# Altium project Alim2015.PrjPCB
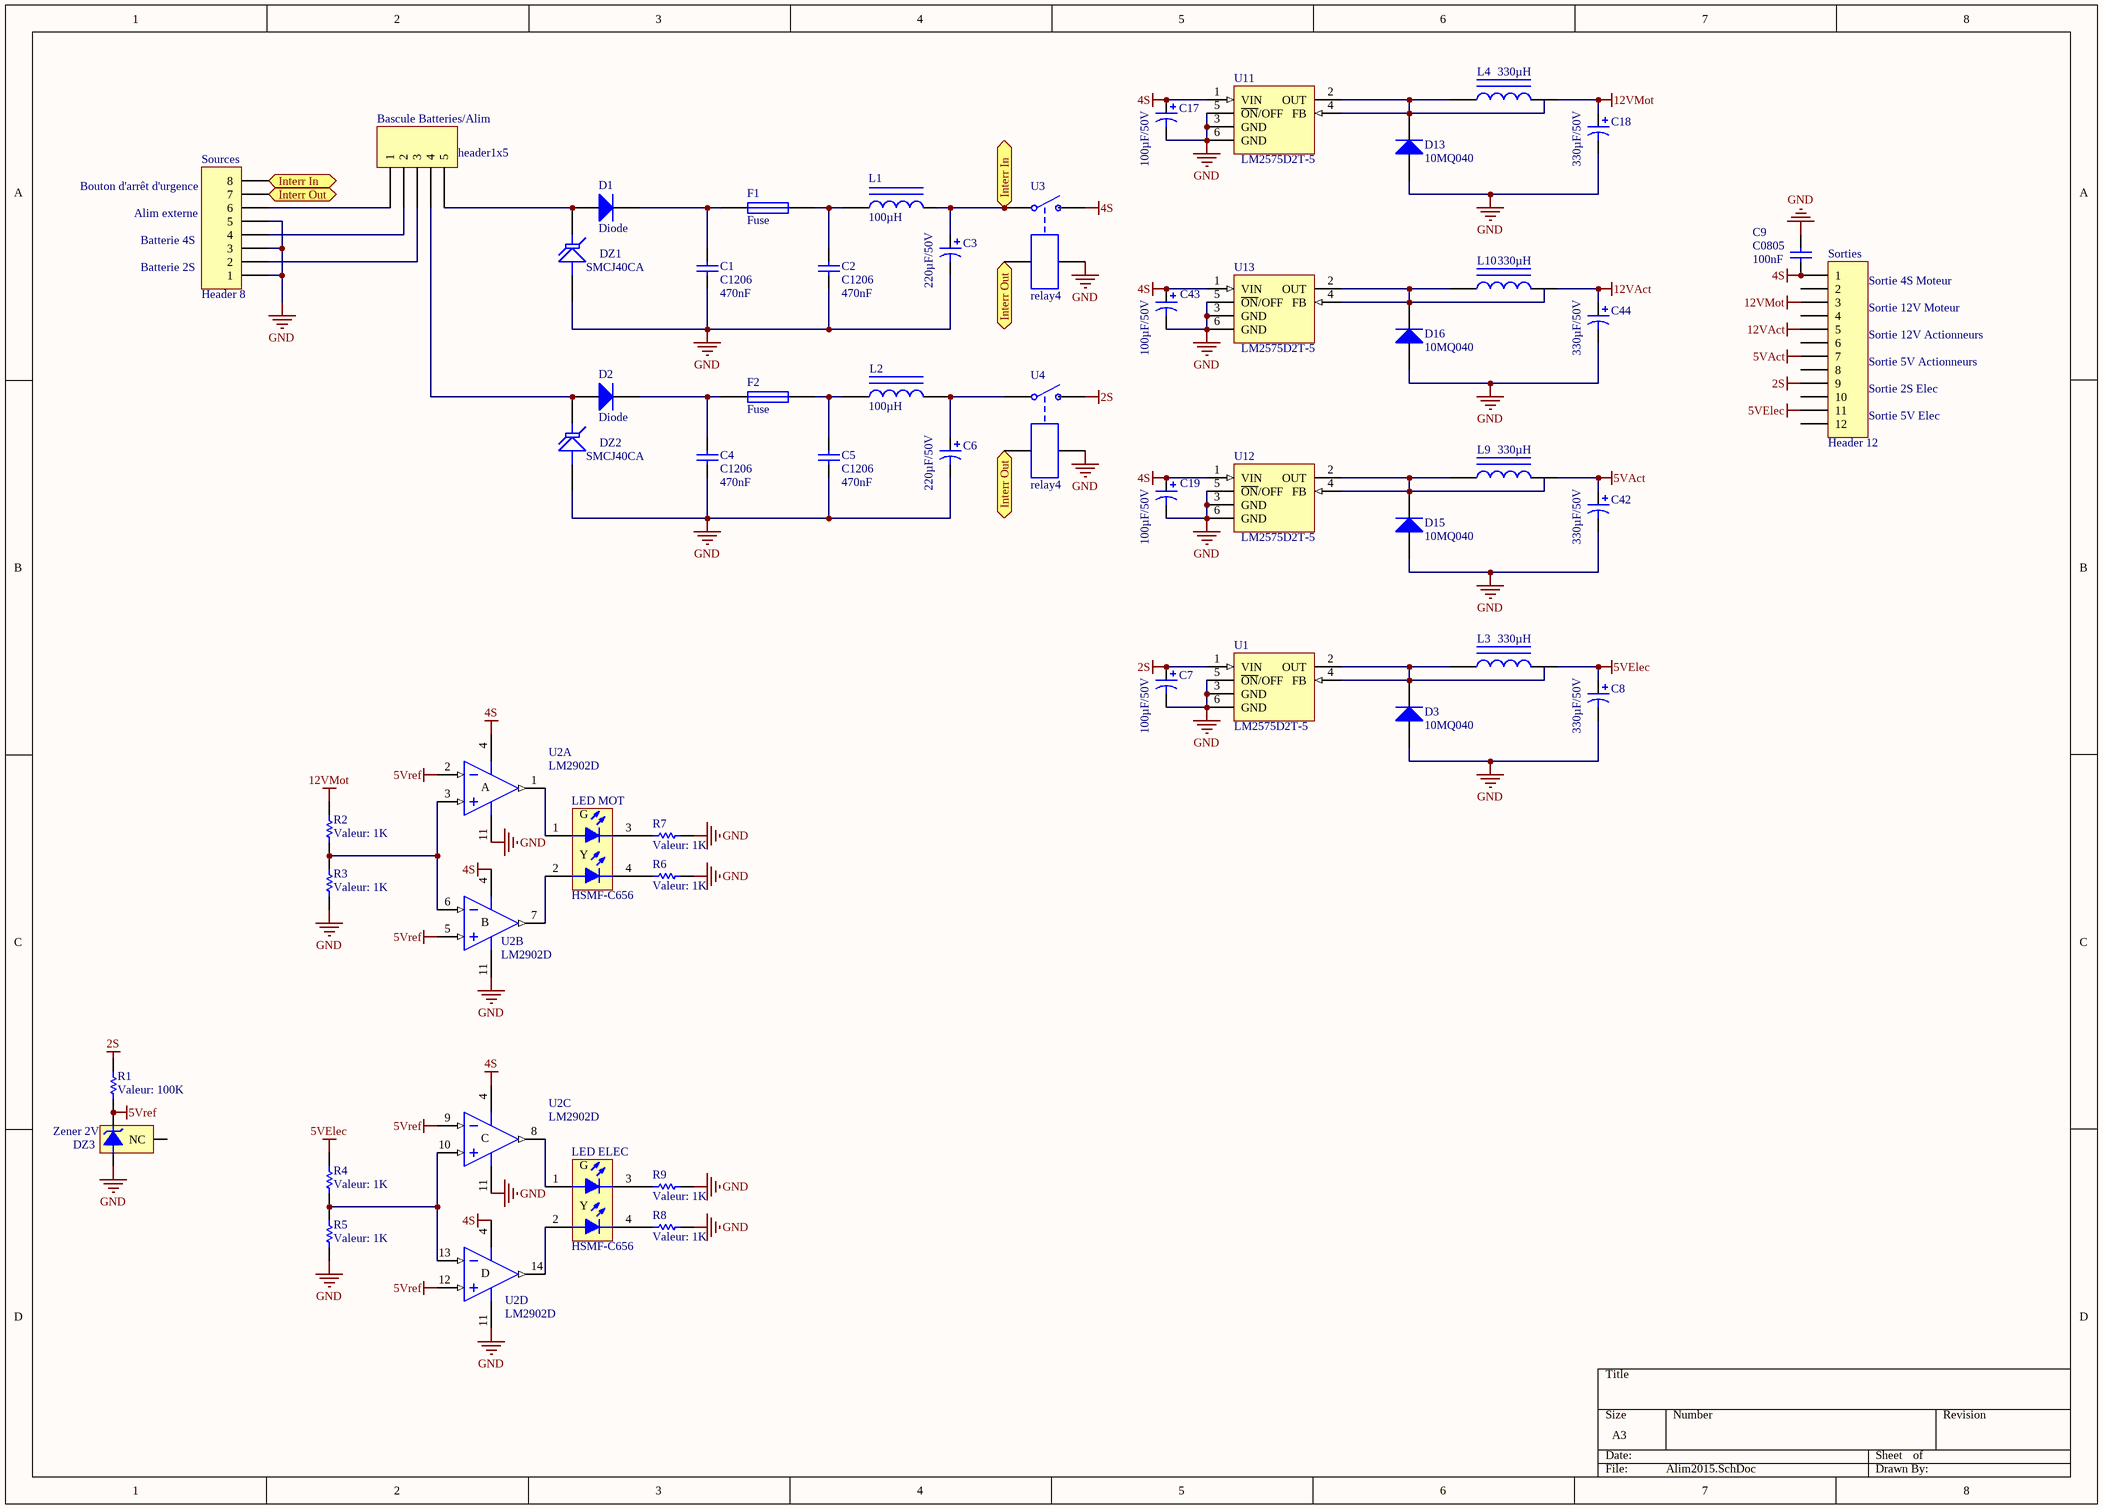
[diagram p0: Alim2015.SchDoc]
1 sheet, 53 parts. Net scope: flat (ports and power ports of the same name join across sheets).
Board file: Alim2015.PcbDoc

## Sheet Alim2015.SchDoc
size A3

### Parts
Bascule_Batteries/Alim  header1x5  [HDR1X4]
C1  C1206  value 470nF  [1206]
C2  C1206  value 470nF  [1206]
C3  220µF/50V  [Cap-D6]
C4  C1206  value 470nF  [1206]
C5  C1206  value 470nF  [1206]
C6  220µF/50V  [Cap-D6]
C7  100µF/50V  [Cap-D6]
C8  330µF/50V  [Cap-D6]
C9  C0805  value 100nF  [0805]
C17  100µF/50V  [Cap-D6]
C18  330µF/50V  [Cap-D6]
C19  100µF/50V  [Cap-D6]
C42  330µF/50V  [Cap-D6]
C43  100µF/50V  [Cap-D6]
C44  330µF/50V  [Cap-D6]
D1  Diode  [DSO-C2/X3.3]
D2  Diode  [DSO-C2/X3.3]
D3  10MQ040  [DSO-C2/X1.8]
D13  10MQ040  [DSO-C2/X1.8]
D15  10MQ040  [DSO-C2/X1.8]
D16  10MQ040  [DSO-C2/X1.8]
DZ1  SMCJ40CA  [DSO-C2/X3.3]
DZ2  SMCJ40CA  [DSO-C2/X3.3]
DZ3  Zener 2V  [MF03A_N]
F1  Fuse  [FUSE MF-SM050]
F2  Fuse  [FUSE MF-SM050]
L1  100µH  [SELF1]
L2  100µH  [SELF1]
L3  330µH  [SELF1]
L4  330µH  [SELF1]
L9  330µH  [SELF1]
L10  330µH  [SELF1]
LED_ELEC  HSMF-C656  [3.2X2.7X1.1A]
LED_MOT  HSMF-C656  [3.2X2.7X1.1A]
R1  Valeur: 100K  [ERA-0805]  (hidden comment: ERA6Y)
R2  Valeur: 1K  [ERA-0805]  (hidden comment: ERA6Y)
R3  Valeur: 1K  [ERA-0805]  (hidden comment: ERA6Y)
R4  Valeur: 1K  [ERA-0805]  (hidden comment: ERA6Y)
R5  Valeur: 1K  [ERA-0805]  (hidden comment: ERA6Y)
R6  Valeur: 1K  [ERA-0805]  (hidden comment: ERA6Y)
R7  Valeur: 1K  [ERA-0805]  (hidden comment: ERA6Y)
R8  Valeur: 1K  [ERA-0805]  (hidden comment: ERA6Y)
R9  Valeur: 1K  [ERA-0805]  (hidden comment: ERA6Y)
Sorties  Header 12  [HDR1X12]
Sources  Header 8  [EMBMCS8]
U1  LM2575D2T-5  [936A-02]
U2  LM2902D  [D014_N]  (parts A,B,C,D of 4)
U3  relay4  [Relay 4]
U4  relay4  [Relay 4]
U11  LM2575D2T-5  [936A-02]
U12  LM2575D2T-5  [936A-02]
U13  LM2575D2T-5  [936A-02]

### Ports
Interr In, Interr Out

### Nets
2S: C7.1 Sorties.9 U1.1(VIN) U4.2
4S: C9.2 C17.1 C19.1 C43.1 Sorties.1 U2.4(V+) U3.2 U11.1(VIN) U12.1(VIN) U13.1(VIN)
5VAct: C42.1 L9.2 Sorties.7
5VElec: C8.1 L3.2 R4.1 Sorties.11
5Vref: DZ3.1(+V) R1.2 U2.2(IN-) U2.5(IN+) U2.9(IN-) U2.12(IN+)
12VAct: C44.1 L10.2 Sorties.5
12VMot: C18.1 L4.2 R2.1 Sorties.3
GND: C1.1 C2.1 C3.2 C4.1 C5.1 C6.2 C7.2 C8.2 C9.1 C17.2 C18.2 C19.2 C42.2 C43.2 C44.2 D3.1(A) D13.1(A) D15.1(A) D16.1(A) DZ1.1(A) DZ2.1(A) DZ3.2(-V) R3.2 R5.2 R6.2 R7.2 R8.2 R9.2 Sources.1 Sources.3 Sources.5 U1.3(GND) U1.5(~{ON}/OFF) U1.6(GND) U2.11(V-) U3.4 U4.4 U11.3(GND) U11.5(~{ON}/OFF) U11.6(GND) U12.3(GND) U12.5(~{ON}/OFF) U12.6(GND) U13.3(GND) U13.5(~{ON}/OFF) U13.6(GND)
NetBascule_Batteries/Alim_1: Bascule_Batteries/Alim.1 Sources.6
NetBascule_Batteries/Alim_2: Bascule_Batteries/Alim.2 Sources.4
NetBascule_Batteries/Alim_3: Bascule_Batteries/Alim.3 Sources.2
NetBascule_Batteries/Alim_4: Bascule_Batteries/Alim.4 D2.1(A) DZ2.2(K)
NetBascule_Batteries/Alim_5: Bascule_Batteries/Alim.5 D1.1(A) DZ1.2(K)
NetC1_2: C1.2 D1.2(K) F1.1
NetC2_2: C2.2 F1.2 L1.1
NetC3_1: C3.1 L1.2 Sources.8 U3.1 ; port Interr In
NetC4_2: C4.2 D2.2(K) F2.1
NetC5_2: C5.2 F2.2 L2.1
NetC6_1: C6.1 L2.2 U4.1
NetD3_2: D3.2(K) L3.1 U1.2(OUT) U1.4(FB)
NetD13_2: D13.2(K) L4.1 U11.2(OUT) U11.4(FB)
NetD15_2: D15.2(K) L9.1 U12.2(OUT) U12.4(FB)
NetD16_2: D16.2(K) L10.1 U13.2(OUT) U13.4(FB)
NetLED_ELEC_1: LED_ELEC.1(A1) U2.8(OUT)
NetLED_ELEC_2: LED_ELEC.2(A2) U2.14(OUT)
NetLED_ELEC_3: LED_ELEC.3(K1) R9.1
NetLED_ELEC_4: LED_ELEC.4(K2) R8.1
NetLED_MOT_1: LED_MOT.1(A1) U2.1(OUT)
NetLED_MOT_2: LED_MOT.2(A2) U2.7(OUT)
NetLED_MOT_3: LED_MOT.3(K1) R7.1
NetLED_MOT_4: LED_MOT.4(K2) R6.1
NetR2_2: R2.2 R3.1 U2.3(IN+) U2.6(IN-)
NetR4_2: R4.2 R5.1 U2.10(IN+) U2.13(IN-)
NetSources_7: Sources.7 U3.3 U4.3 ; port Interr Out

Not connected (* = marked no-connect by the designer): DZ3 3(NC); R1 1; Sorties 2 4 6 8 10 12

### Notes on the sheet
- (near Sources) Bouton d'arrêt d'urgence
- (near Sources) Alim externe
- (near Sources) Batterie 4S
- (near Sources) Batterie 2S
- (near Sorties) Sortie 4S Moteur
- (near Sorties) Sortie 12V Moteur
- (near Sorties) Sortie 12V Actionneurs
- (near Sorties) Sortie 5V Actionneurs
- (near Sorties) Sortie 5V Elec
- (near Sorties) Sortie 2S Elec
- Labels drawn without touching a wire or pin: 2S
- (in symbol HSMF-C656) G; Y
- (in symbol LM2902D, part A) A
- (in symbol LM2902D, part B) B
- (in symbol LM2902D, part C) C
- (in symbol LM2902D, part D) D

### Library data of the parts
C1 C2 C4 C5 = C1206: Ceramic Chip Capacitor - Standard; Published: 17-Jul-2002; LatestRevisionDate: 19-Mar-2004; LatestRevisionNote: Silkscreen size reduced.; DatasheetDocument: Mar-2001; PackageDocument: Mar-2001; PackageReference: 1206; Publisher: Altium Limited; Code_JEITA: 1206; Code_IPC: 3216 [1206]; ComponentLink1Description: Manufacturer Link; ComponentLink1URL: http://www.kemet.com/; ComponentLink2Description: Datasheet; ComponentLink2URL: http://www.kemet.com/kemet/web/homepage/kechome.nsf/vapubfilesname/F3102TA.pdf/$file/F3102TA.pdf
C3 C6-C8 C17-C19 C42-C44 = Cap Pol3: Polarized Capacitor (Surface Mount); Published: 8-Jun-2000; LatestRevisionDate: 17-Jul-2002; LatestRevisionNote: Re-released for DXP Platform.; PackageReference: C0805; Publisher: Altium Limited
C9 = C0805: Ceramic Chip Capacitor - Standard; Note: Footprint corresponds to dimensions for bulk cassette packaging. This case size has tightened tolerances.; Published: 17-Jul-2002; LatestRevisionDate: 19-Mar-2004; LatestRevisionNote: Silkscreen size reduced.; DatasheetDocument: Mar-2001; PackageDocument: Mar-2001; PackageReference: 0805; Publisher: Altium Limited; Code_JEITA: 0805; Code_IPC: 2012[0805]; ComponentLink1Description: Manufacturer Link; ComponentLink1URL: http://www.kemet.com/; ComponentLink2Description: Datasheet; ComponentLink2URL: http://www.kemet.com/kemet/web/homepage/kechome.nsf/vapubfilesname/F3102TA.pdf/$file/F3102TA.pdf
D1-D3 D13 D15 D16 = Diode: Default Diode; Published: 8-Jun-2000; LatestRevisionDate: 17-Jul-2002; LatestRevisionNote: Re-released for DXP Platform.; PackageDocument: Sep-1996; PackageReference: SMC; Publisher: Altium Limited; Code_JEDEC: DO-214-AB
DZ1 DZ2 = Tranzorb: Published: 24-Mar-1999; LatestRevisionDate: 17-Jul-2002; LatestRevisionNote: Re-released for DXP Platform.; Publisher: Altium Limited
DZ3 = LM4040AIM3-5.0: Precision Micropower Shunt Voltage Reference; Manufacturer: National Semiconductor; CompType: Voltage Reference IC; PackageTopMarking: R5A*XTT; PowerWise: N; Published: 4-Dec-2008; DatasheetVersion: Apr-2005; PackageVersion: revB, Mar-2003; PackageReference: MF03A; Publisher: Altium Limited; PackageDescription: Molded SOT-23, .115 x .051 x .037in Body, 3 Lead, .075 in Pitch; PartNumber: LM4040AIM3-5.0; RoHS: O; PinCount: 3; DigiKeyPartNumber: LM4040AIM3-5.0CT-ND; ComponentLink1Description: LM4040 Datasheet; ComponentLink1URL: http://www.national.com/ds/LM/LM4040.pdf; ComponentLink2Description: LM4040 Web Page; ComponentLink2URL: http://www.national.com/pf/LM/LM4040.html; ComponentLink3Description: MF03A Package Page; ComponentLink3URL: http://www.national.com/packaging/folders/mf03a.html
F1 F2 = Fuse 1: Published: 8-Jun-2000; LatestRevisionDate: 17-Jul-2002; LatestRevisionNote: Re-released for DXP Platform.; Publisher: Altium Limited
L1-L4 L9 L10 = Inductor Iron: Magnetic-Core Inductor; Published: 24-Mar-1999; LatestRevisionDate: 17-Jul-2002; LatestRevisionNote: Re-released for DXP Platform.; Publisher: Altium Limited
LED_ELEC LED_MOT = HSMF-C656: SMT Bi-Colour Chip LED (Yellow/Green); pin to pad: 1>3 3>4 4>1; LuminousIntensity: 1.6mcd (Minimum).; LED_Colour: Yellow & Green; PCB_Layout: Complies with manufacturer's recommendation.; Published: 11-Dec-2002; DatasheetDocument: ##########; PackageDocument: 29-Oct-2001; PackageReference: 3.2X2.7X1.1A; Publisher: Altium Limited; ComponentLink1Description: Manufacturer Link; ComponentLink1URL: http://www.agilent.com/; ComponentLink2Description: Datasheet; ComponentLink2URL: http://cp.literature.agilent.com/litweb/pdf/5988-4447EN.pdf
R1-R9 = ERA6Y: Rectangular Thick Film Chip Resistor, 10 Ohm to 1M Ohm Range, 0.1% and 0.5% Tolerance, 0805 Size, 0.1 W; Note: If flow soldering, adjust pad width of PCB Footprint to 0.7 - 0.8 times the width of the resistor.; Published: 17-Dec-2003; LatestRevisionDate: 19-Mar-2004; LatestRevisionNote: Silkscreen size reduced.; PackageDocument: Mar-2003; PackageReference: ERA-0805; Publisher: Altium Limited; Code_IPC: 2012 [0805]; ComponentLink1Description: Manufacturer Link; ComponentLink1URL: http://www.panasonic.com/industrial/components/resistive_products.htm; ComponentLink2Description: Datasheet; ComponentLink2URL: http://www.panasonic.com/industrial/components/pdf/AOA0000CE8.pdf
Sorties = Header 12: Header, 12-Pin; LatestRevisionDate: 17-Jul-2002; LatestRevisionNote: Re-released for DXP Platform.; Publisher: Altium Limited
Sources = Header 8: Header, 8-Pin; LatestRevisionDate: 17-Jul-2002; LatestRevisionNote: Re-released for DXP Platform.; Publisher: Altium Limited
U1 U11-U13 = LM2575D2T-5: Easy Switcher 1.0A Step-Down Voltage Regulator; Note: Pin 3 is electrically connected to Pin 6;Pin 6 is heatsink; Published: 15-Apr-2002; DatasheetVersion: Jul-1999; PackageVersion: Jul-1999; PackageReference: 936A-02; Publisher: Altium Limited; PackageDescription: D2-PAK; 5 Leads; Body 14.7 (inc. leads) x 10.2 mm (LxW max); ComponentLink1Description: Manufacturer Link; ComponentLink1URL: http://www.onsemi.com/site/products/taxonomy/0,4438,503,00.html; ComponentLink2Description: Datasheet; ComponentLink2URL: http://www.onsemi.com/pub/Collateral/LM2575-D.PDF
U2 = LM2902D: Quadruple Operational Amplifier; Published: 16-Jan-2001; LatestRevisionDate: 13-Apr-2006; LatestRevisionNote: IPC-7351 Footprint Added.; DatasheetVersion: Feb-1997; PackageVersion: Jan-1998; PackageReference: D014; Publisher: Altium Limited; PackageDescription: 14-Pin Small Outline Integrated Circuit 1.27 mm Pitch; Code_IPC: SOIC127P600-14; ComponentLink1Description: Manufacturer Link; ComponentLink1URL: http://www.ti.com/; ComponentLink2Description: Datasheet; ComponentLink2URL: http://www-s.ti.com/sc/ds/lm2902.pdf